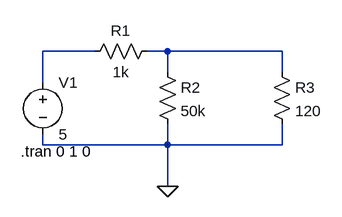
[diagram p0: schematic 2022-11-30_Voltage_Divider.asc]
2022-11-30_Voltage_Divider.asc, the LTspice schematic file:
Version 4
SHEET 1 880 680
WIRE 160 160 80 160
WIRE 272 160 240 160
WIRE 448 160 272 160
WIRE 272 192 272 160
WIRE 448 192 448 160
WIRE 80 208 80 160
WIRE 80 304 80 288
WIRE 272 304 272 272
WIRE 272 304 80 304
WIRE 448 304 448 272
WIRE 448 304 272 304
WIRE 272 368 272 304
FLAG 272 368 0
SYMBOL voltage 80 192 R0
WINDOW 123 0 0 Left 0
WINDOW 39 24 124 Left 2
SYMATTR InstName V1
SYMATTR Value 5
SYMBOL res 432 176 R0
SYMATTR InstName R3
SYMATTR Value 120
SYMBOL res 144 176 R270
WINDOW 0 32 56 VTop 2
WINDOW 3 0 56 VBottom 2
SYMATTR InstName R1
SYMATTR Value 1k
SYMBOL res 256 176 R0
SYMATTR InstName R2
SYMATTR Value 50k
TEXT 46 314 Left 2 !.tran 0 1 0

The netlist it stands for:
* 2022-11-30_Voltage_Divider.asc
V1 N001 0 5
R3 N002 0 120
R1 N001 N002 1k
R2 N002 0 50k
.tran 0 1 0
.backanno
.end